# EAGLE design eCog103_Sensor (EAGLE 6.6.0)
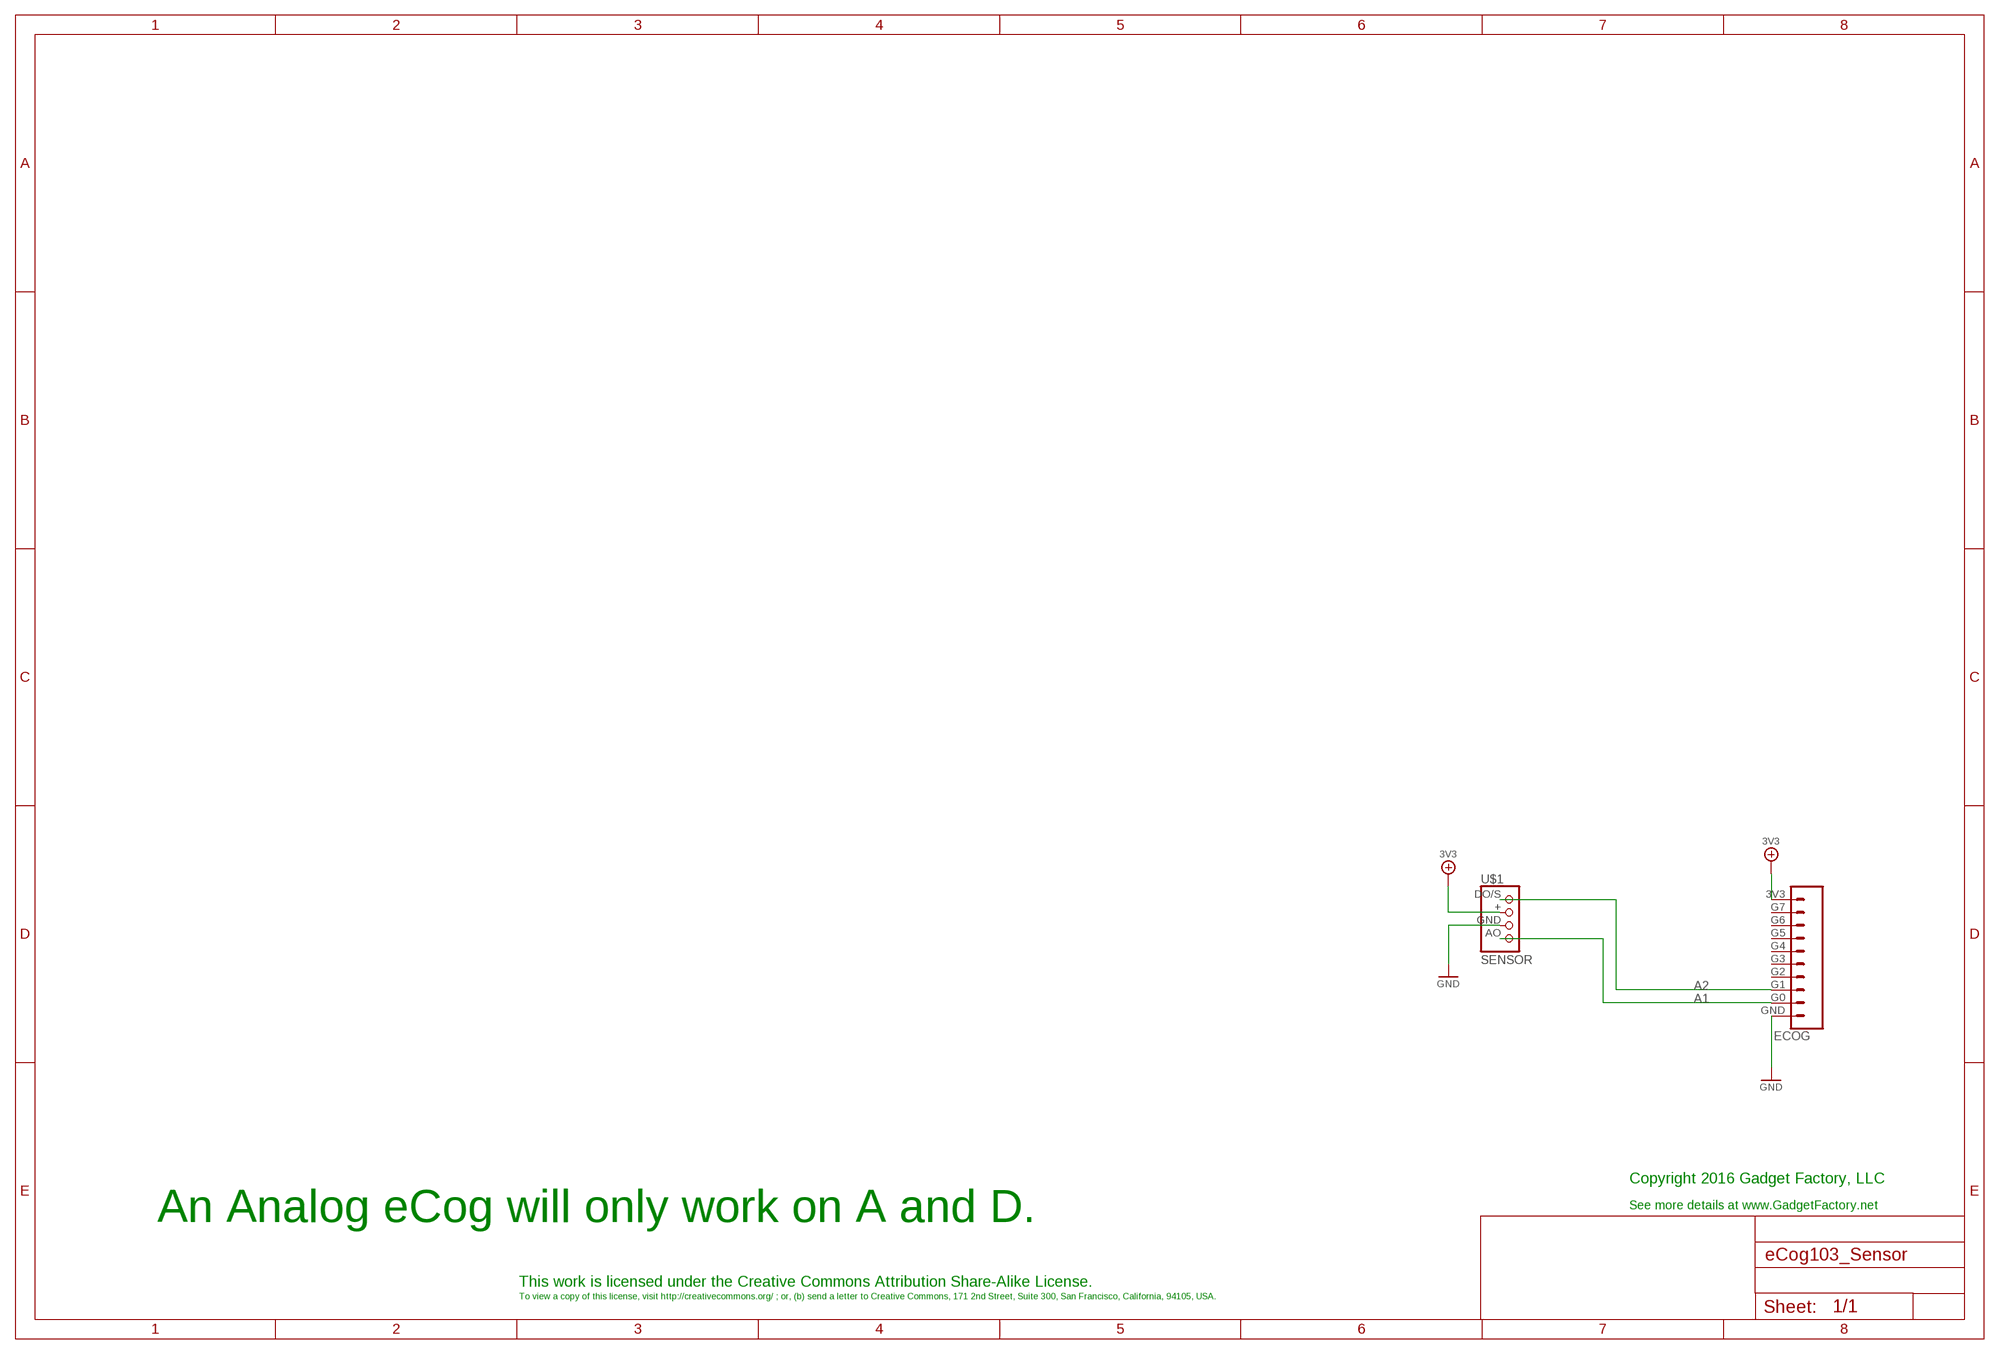
[diagram p0: schematic, sheet 1]

## Parts
ECOG  ECOG_GENERAL_ROWECOG_GENERAL_SMD  [ECOG_GENERAL_SMD]
U$1  SENSOR  [SENSOR-HJX4]

## Nets
3V3: ECOG.3V3 U$1.+
A1: ECOG.G0 U$1.AO
A2: ECOG.G1 U$1.DO/S
GND: ECOG.GND U$1.GND
Unconnected: ECOG.G2 ECOG.G3 ECOG.G4 ECOG.G5 ECOG.G6 ECOG.G7

## Notes on the sheet
- Copyright 2016 Gadget Factory, LLC
- See more details at www.GadgetFactory.net
- An Analog eCog will only work on A and D.
- This work is licensed under the Creative Commons Attribution Share-Alike License.
- To view a copy of this license, visit http://creativecommons.org/ ; or, (b) send a letter to Creative Commons, 171 2nd Street, Suite 300, San Francisco, California, 94105, USA.

## Library data of the parts
ECOG = eCogs:ECOG_GENERAL_ROW; DIGIKEY: S1013EC-10-ND
U$1 = eCogs:SENSOR

## Board
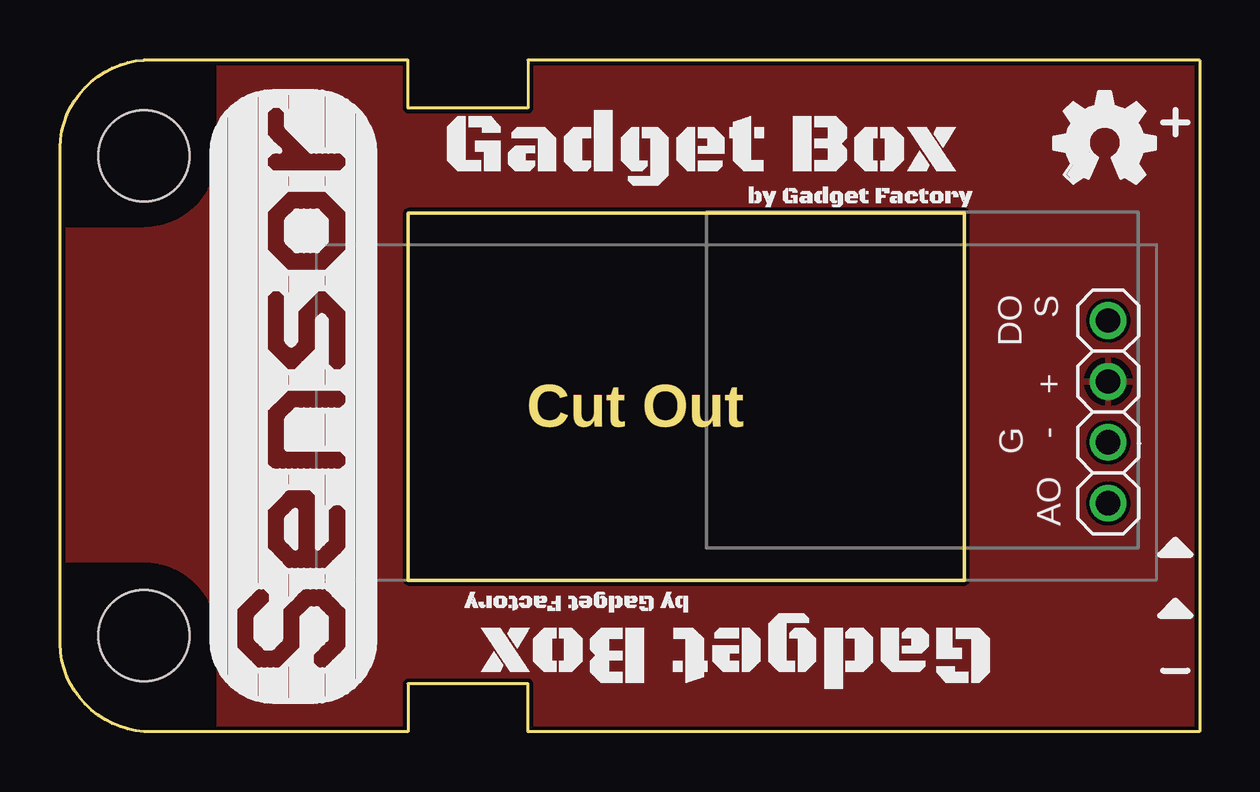
[diagram p1: board, top side]
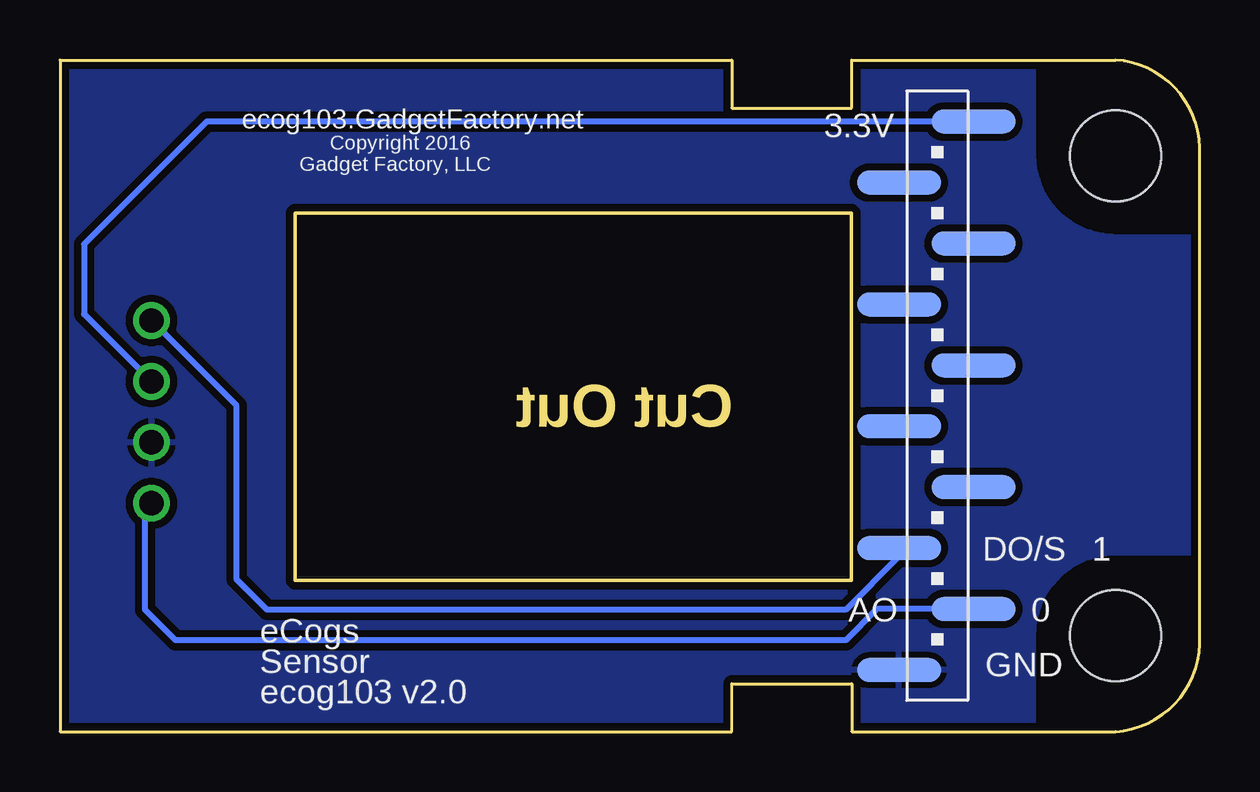
[diagram p2: board, bottom side, seen from below]

Size 47.51 x 28 mm. Coordinates in mm from the lower left corner, seen from the top.
Copper layers (1*16): Top 0.035mm / dielectric 1.5mm / Bottom 0.035mm
Design rules "hackvana *": minimum track width 6mil, minimum drill 0.3mm, track to track 6mil, track to pad 6mil, pad to pad 6mil, via to via 6mil, smd to smd 0mil, copper to edge 6mil, drill to drill 6mil, minimum pad ring 10mil, minimum via ring 6mil, stop-mask expansion 2mil, vias tented up to drill 100mil, thermal gap 10mil

### Footprints (pad centres in the part's own frame; a part is rotated, then mirrored left to right if it is on the bottom)
ECOG_GENERAL_SMD = smd 3.5 x 1 bottom: 3V3 9.923,25.429; G0 9.923,5.111; G1 13.022,7.649; G2 9.923,10.189; G3 13.022,12.729; G4 9.923,15.269; G5 13.022,17.809; G6 9.923,20.349; G7 13.022,22.889; GND 13.022,2.571 | hole 3.8: 4,24; 4,4
SENSOR-HJX4 = drill 1.016: + -1.29,-2.01; AO 3.79,-2.01; DO/S -3.83,-2.01; GND 1.25,-2.01

### Placement (x,y rotation side)
ECOG  -0.49,0 0 top
U$1  45.7,13.3 270 top
U$2  [LEGEND_ANALOG]  46.5,7.62 0 top
U$3  [LEGEND_ANALOG]  46.5,5.08 0 top
U$4  [GADGETBOX_SMALL]  26.81,24.26 0 top
U$5  [OSHW_FILLX150_NOTEXT]  41.42,22.86 0 top
U$6  [GADGETBOX_SMALL]  28.08,3.43 180 top

### Tracks (layer width: path | path; a pad name or v marks a point on that pad's centre or on a via)
3V3
  Bottom 0.254: ECOG.3V3 41.39,25.43 46.5,20.32 46.5,17.4 U$1.+
  pour Top: -1.76,29.27 48.78,29.27 48.78,-1.27 -1.76,-1.27
A1
  Bottom 0.254: ECOG.G0 13.45,5.11 14.75,3.81 42.69,3.81 43.96,5.08 43.96,9.25 U$1.AO
A2
  Bottom 0.254: ECOG.G1 12.53,7.3 14.75,5.08 38.88,5.08 40.15,6.35 40.15,13.59 U$1.DO/S
GND
  pour Bottom (isolate 0.305): -3.03,30.54 50.05,30.54 50.05,-2.54 -3.03,-2.54

### Text on the board
Dimension: Cut Out
bPlace: 3.3V | ecog103.GadgetFactory.net | Copyright 2016 | Gadget Factory, LLC | 1 | DO/S | 0 | AO | eCogs | GND | Sensor | ecog103 v2.0